# Altium schematic sheet Sheet2.SchDoc
size A4; SheetNumber: 3; SheetTotal: 3
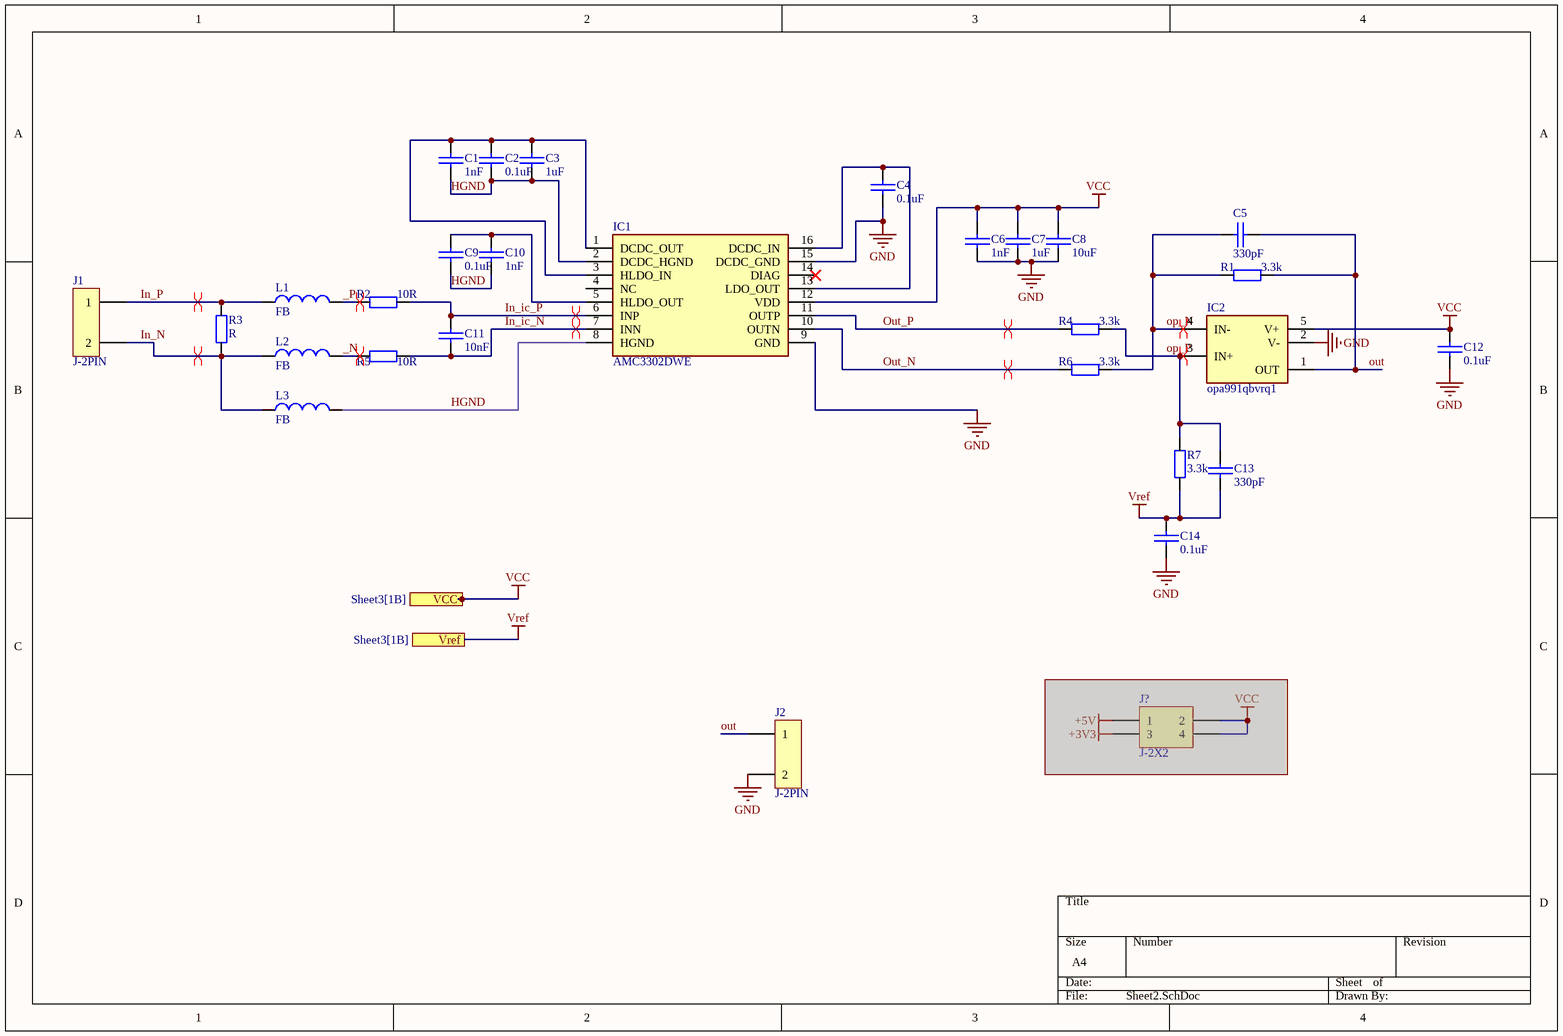
[diagram p0: Sheet2.SchDoc]

## Parts
C1  1nF  [C-0603]
C2  0.1uF  [C-0603]
C3  1uF  [C-0603]
C4  0.1uF  [C-0603]
C5  330pF  [C-0603]
C6  1nF  [C-0603]
C7  1uF  [C-0603]
C8  10uF  [C-0603]
C9  0.1uF  [C-0603]
C10  1nF  [C-0603]
C11  10nF  [C-0603]
C12  0.1uF  [C-0603]
C13  330pF  [C-0603]
C14  0.1uF  [C-0603]
IC1  AMC3302DWE  [SOIC127P1030X265-16N]
IC2  opa991qbvrq1  [SOT95P280X145-5N]
J1  J-2PIN  [2pin]
J2  J-2PIN  [SMA RF同轴链接器]
J?  J-2X2  [PCBComponent_1]  (masked out: inside a compile mask, not in the netlist)
L1  FB  [L-0402]
L2  FB  [L-0402]
L3  FB  [L-0402]
R1  3.3k  [R-0603]
R2  10R  [R-0603]
R3  R  [R-2512]
R4  3.3k  [R-0603]
R5  10R  [R-0603]
R6  3.3k  [R-0603]
R7  3.3k  [R-0603]

## Ports
VCC (see Sheet3[1B]), Vref (see Sheet3[1B])

## Nets
GND: C4.2 C6.2 C7.2 C8.2 C12.1 C14.1 IC1.9(GND) IC1.15(DCDC_GND) IC2.2(V-) J2.2
VCC: C6.1 C7.1 C8.1 C12.2 IC1.12(VDD) IC2.5(V+) ; port VCC
Vref: C13.1 C14.2 R7.1 ; port Vref
_N: L2.2 R5.1
_P: L1.2 R2.1
HGND: C1.2 C2.2 C3.2 C9.2 C10.2 IC1.2(DCDC_HGND) IC1.8(HGND) L3.2
In_ic_N: C11.2 IC1.7(INN) R5.2
In_ic_P: C11.1 IC1.6(INP) R2.2
In_N: J1.2 L2.1 L3.1 R3.1
In_P: J1.1 L1.1 R3.2
op_N: C5.1 IC2.4(IN-) R1.1 R6.2
op_P: C13.2 IC2.3(IN+) R4.2 R7.2
out: C5.2 IC2.1(OUT) J2.1 R1.2
Out_N: IC1.10(OUTN) R6.1
Out_P: IC1.11(OUTP) R4.1
NetC1_1: C1.1 C2.1 C3.1 IC1.1(DCDC_OUT) IC1.3(HLDO_IN)
NetC4_1: C4.1 IC1.13(LDO_OUT) IC1.16(DCDC_IN)
NetC9_1: C9.1 C10.1 IC1.5(HLDO_OUT)

Not connected (* = marked no-connect by the designer): IC1 4(NC) 14(DIAG)*

## Layout directives
differential pair: _N, _P, In_ic_N, In_ic_P, In_N, In_P, op_N, op_P, Out_N, Out_P

## Library data of the parts
C1-C14 = C: Non Polarised
IC1 = AMC3302DWE: Integrated Circuit; Manufacturer_Name: Texas Instruments; Datasheet Link: https://www.ti.com/lit/ds/symlink/amc3302.pdf?ts=1643366130509; Height: 2.65mm; Manufacturer_Part_Number: AMC3302DWE; Mouser Part Number: 595-AMC3302DWE; Mouser Price/Stock: https://www.mouser.co.uk/ProductDetail/Texas-Instruments/AMC3302DWE?qs=DRkmTr78QAT3OfY8Rd%252BeWA%3D%3D; Arrow Part Number: AMC3302DWE; Arrow Price/Stock: https://www.arrow.com/en/products/amc3302dwe/texas-instruments?region=nac
IC2 = TLV9001IDBVR: Integrated Circuit; Manufacturer_Name: Texas Instruments; Datasheet Link: http://www.ti.com/lit/gpn/tlv9001; Height: 1.45mm; Manufacturer_Part_Number: TLV9001IDBVR; Mouser Part Number: 595-TLV9001IDBVR; Mouser Price/Stock: https://www.mouser.co.uk/ProductDetail/Texas-Instruments/TLV9001IDBVR?qs=gTYE2QTfZfR6dUkET6Yj7w%3D%3D; Arrow Part Number: TLV9001IDBVR; Arrow Price/Stock: https://www.arrow.com/en/products/tlv9001idbvr/texas-instruments?region=europe
L1-L3 = L-SMD: 1.8k@100Mhz
R1-R7 = R: Resistor
J? = J-2X2: LatestRevisionDate: 17-Jul-2002; LatestRevisionNote: Re-released for DXP Platform.; Publisher: Altium Limited